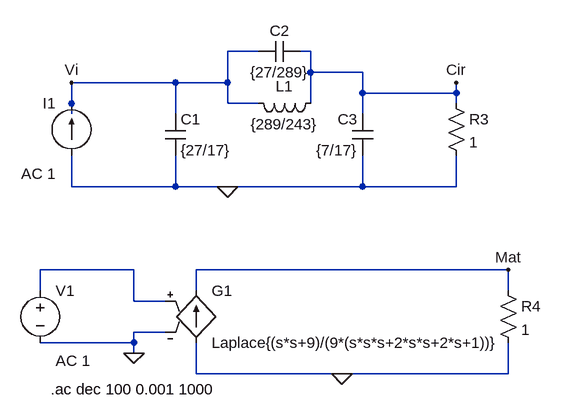
[diagram p0: schematic ej2.asc]
ej2.asc, the LTspice schematic file:
Version 4
SHEET 1 880 680
WIRE 160 64 112 64
WIRE 240 64 224 64
WIRE 240 96 240 64
WIRE 320 96 240 96
WIRE 32 112 -128 112
WIRE 112 112 112 64
WIRE 112 112 32 112
WIRE 320 128 320 96
WIRE 464 128 464 112
WIRE 464 128 320 128
WIRE -128 144 -128 112
WIRE 112 144 112 112
WIRE 160 144 112 144
WIRE 240 144 240 96
WIRE 464 144 464 128
WIRE -128 160 -128 144
WIRE 32 160 32 112
WIRE 320 160 320 128
WIRE -128 272 -128 224
WIRE 32 272 32 224
WIRE 32 272 -128 272
WIRE 112 272 32 272
WIRE 320 272 320 224
WIRE 320 272 112 272
WIRE 464 272 464 224
WIRE 464 272 320 272
WIRE -32 400 -176 400
WIRE 544 400 64 400
WIRE -176 432 -176 400
WIRE 64 432 64 400
WIRE 544 432 544 400
WIRE -32 448 -32 400
WIRE 16 448 -32 448
WIRE 16 496 -32 496
WIRE -32 512 -32 496
WIRE -32 512 -176 512
WIRE -32 528 -32 512
WIRE 64 560 64 512
WIRE 288 560 64 560
WIRE 544 560 544 512
WIRE 544 560 288 560
FLAG 112 272 0
FLAG 288 560 0
FLAG -128 112 Vi
FLAG -32 528 0
FLAG 544 400 Mat
FLAG 464 112 Cir
SYMBOL res 528 416 R0
SYMATTR InstName R4
SYMATTR Value 1
SYMBOL current -128 224 R180
WINDOW 0 24 80 Left 2
WINDOW 3 24 0 Left 2
WINDOW 123 24 -28 Left 2
WINDOW 39 0 0 Left 0
SYMATTR InstName I1
SYMATTR Value ""
SYMATTR Value2 AC 1
SYMBOL res 448 128 R0
SYMATTR InstName R3
SYMATTR Value 1
SYMBOL g 64 416 R0
SYMATTR InstName G1
SYMATTR Value Laplace{(s*s+9)/(9*(s*s*s+2*s*s+2*s+1))}
SYMBOL voltage -176 416 R0
WINDOW 123 24 124 Left 2
WINDOW 39 0 0 Left 0
SYMATTR InstName V1
SYMATTR Value ""
SYMATTR Value2 AC 1
SYMBOL cap 16 160 R0
SYMATTR InstName C1
SYMATTR Value {27/17}
SYMBOL cap 224 48 R90
WINDOW 0 0 32 VBottom 2
WINDOW 3 32 32 VTop 2
SYMATTR InstName C2
SYMATTR Value {27/289}
SYMBOL cap 336 224 R180
WINDOW 0 24 56 Left 2
WINDOW 3 24 8 Left 2
SYMATTR InstName C3
SYMATTR Value {7/17}
SYMBOL ind 256 128 R90
WINDOW 0 5 56 VBottom 2
WINDOW 3 32 56 VTop 2
SYMATTR InstName L1
SYMATTR Value {289/243}
TEXT -160 584 Left 2 !.ac dec 100 0.001 1000

The netlist it stands for:
* ej2.asc
R4 Mat 0 1
I1 0 Vi AC 1
R3 Cir 0 1
G1 0 Mat N001 0 Laplace{(s*s+9)/(9*(s*s*s+2*s*s+2*s+1))}
V1 N001 0 AC 1
C1 Vi 0 {27/17}
C2 Cir Vi {27/289}
C3 0 Cir {7/17}
L1 Cir Vi {289/243}
.ac dec 100 0.001 1000
.backanno
.end